# Altium schematic sheet oled.SchDoc
size A4
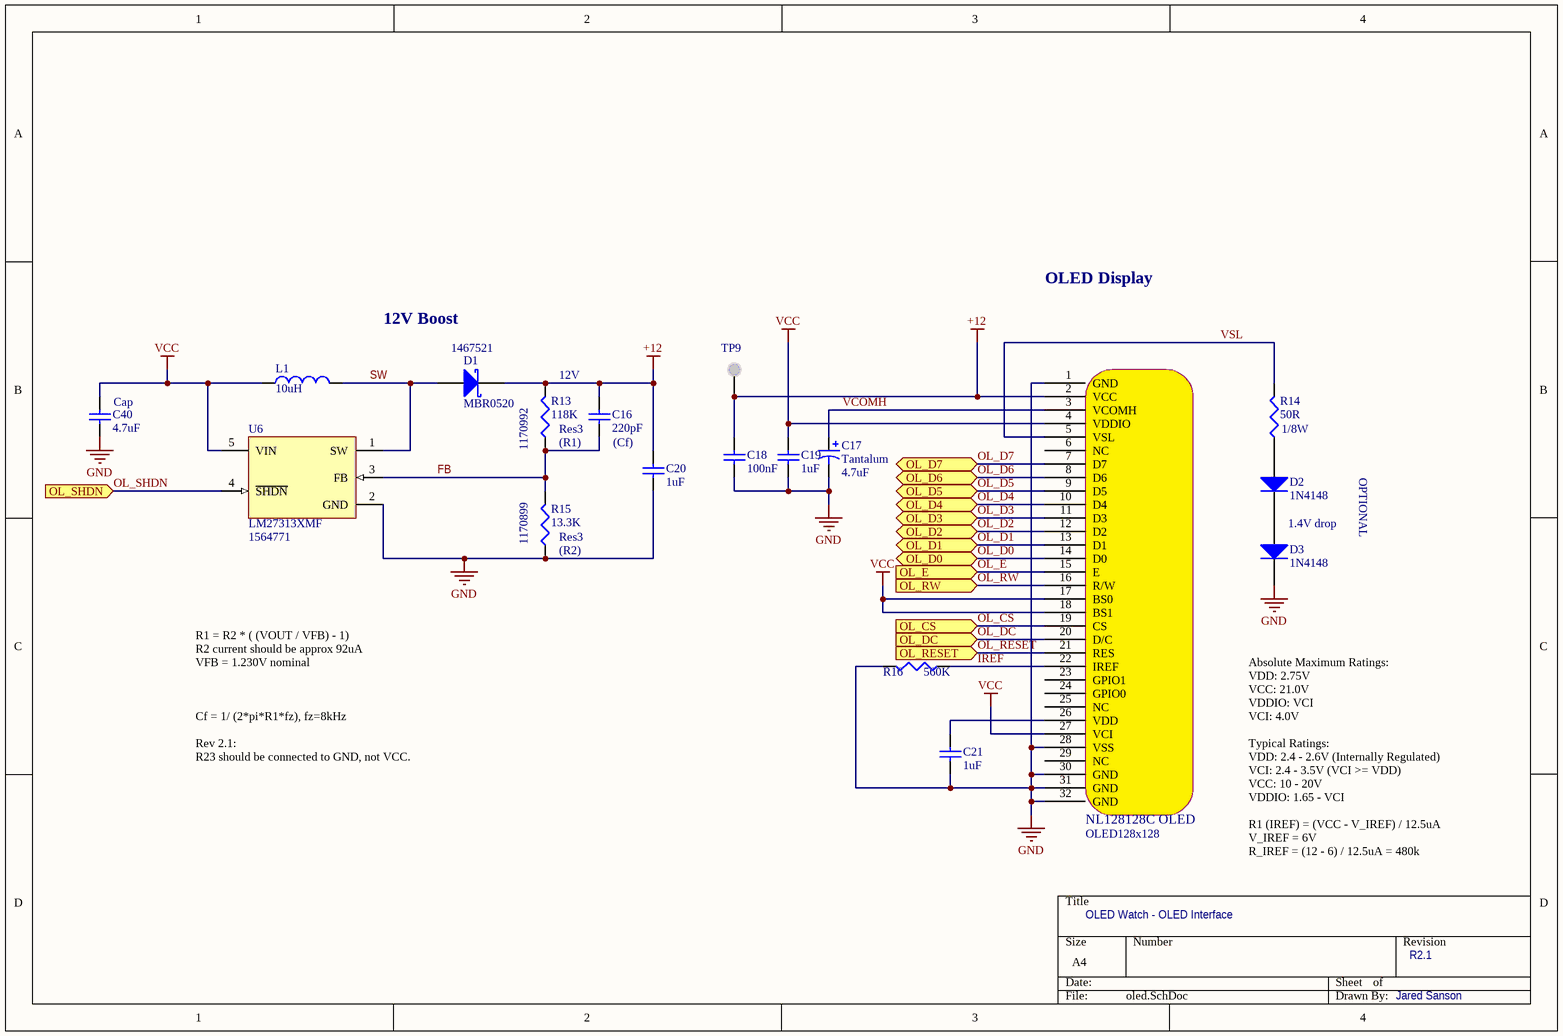
[diagram p0: oled.SchDoc]

## Parts
C16  value 220pF  Variable: (Cf)  [0603C]  (hidden comment: Cap)
C17  Tantalum  value 4.7uF  [0805C]
C18  value 100nF  [0603C]  (hidden comment: Cap)
C19  value 1uF  [0603C]  (hidden comment: Cap)
C20  value 1uF  [0805C]  (hidden comment: Cap)
C21  value 1uF  [0805C]  (hidden comment: Cap)
C40  Cap  value 4.7uF  [0805C]
D1  MBR0520  Supplier Part Number 1: 1467521  [0603D]
D2  1N4148  [0603D]
D3  1N4148  [0603D]
L1  value 10uH  [INDC3225N]  (hidden comment: Inductor)
OLED128x128  OLED128x128  [OLED128X128]  (value not drawn)
R13  Res3  value 118K  Variable: (R1)  Supplier Part Number 1: 1170992  [0603R]
R14  value 50R  [0603R]  (hidden comment: Res3)
R15  Res3  value 13.3K  Variable: (R2)  Supplier Part Number 1: 1170899  [0603R]
R16  value 560K  [0603R]  (hidden comment: Res3)
TP9  +12  [TESTPOINT_TOP]  (value not drawn)
U6  LM27313XMF  Supplier Part Number 1: 1564771  [MF05A_N]

## Ports
OL_CS (in), OL_D0 (bidir), OL_D1 (bidir), OL_D2 (bidir), OL_D3 (bidir), OL_D4 (bidir), OL_D5 (bidir), OL_D6 (bidir), OL_D7 (bidir), OL_DC (in), OL_E (in), OL_RESET (in), OL_RW (in), OL_SHDN (in)

## Nets
+12: C16.1 C18.1 C20.1 D1.2(K) OLED128x128.2(VCC) R13.2 TP9.1(TP)
GND: C17.2 C18.2 C19.2 C20.2 C21.2 C40.2 D3.2(K) OLED128x128.1(GND) OLED128x128.28(VSS) OLED128x128.30(GND) OLED128x128.31(GND) OLED128x128.32(GND) R15.1 R16.2 U6.2(GND)
VCC: C19.1 C40.1 L1.1 OLED128x128.4(VDDIO) OLED128x128.17(BS0) OLED128x128.18(BS1) OLED128x128.27(VCI) U6.5(VIN)
FB: C16.2 R13.1 R15.2 U6.3(FB)
IREF: OLED128x128.22(IREF) R16.1
OL_CS: OLED128x128.19(CS) ; port OL_CS
OL_D0: OLED128x128.14(D0) ; port OL_D0
OL_D1: OLED128x128.13(D1) ; port OL_D1
OL_D2: OLED128x128.12(D2) ; port OL_D2
OL_D3: OLED128x128.11(D3) ; port OL_D3
OL_D4: OLED128x128.10(D4) ; port OL_D4
OL_D5: OLED128x128.9(D5) ; port OL_D5
OL_D6: OLED128x128.8(D6) ; port OL_D6
OL_D7: OLED128x128.7(D7) ; port OL_D7
OL_DC: OLED128x128.20(D/C) ; port OL_DC
OL_E: OLED128x128.15(E) ; port OL_E
OL_RESET: OLED128x128.21(RES) ; port OL_RESET
OL_RW: OLED128x128.16(R/W) ; port OL_RW
OL_SHDN: U6.4(~{SHDN}) ; port OL_SHDN
SW: D1.1(A) L1.2 U6.1(SW)
VCOMH: C17.1 OLED128x128.3(VCOMH)
VSL: OLED128x128.5(VSL) R14.2
NetC21_1: C21.1 OLED128x128.26(VDD)
NetD2_1: D2.1(A) R14.1
NetD2_2: D2.2(K) D3.1(A)

Not connected (* = marked no-connect by the designer): OLED128x128 6(NC) 23(GPIO1) 24(GPIO0) 25(NC) 29(NC)

## Notes on the sheet
- OLED Display
- 12V Boost
- (near R13) 12V
- (near R14) 1/8W
- OPTIONAL
- 1.4V drop
- R1 = R2 * ( (VOUT / VFB) - 1)
  R2 current should be approx 92uA
  VFB = 1.230V nominal
  Cf = 1/ (2*pi*R1*fz), fz=8kHz
  Rev 2.1:
  R23 should be connected to GND, not VCC.
- OLED Watch - OLED Interface
- Absolute Maximum Ratings:
  VDD: 2.75V
  VCC: 21.0V
  VDDIO: VCI
  VCI: 4.0V
  Typical Ratings:
  VDD: 2.4 - 2.6V (Internally Regulated)
  VCI: 2.4 - 3.5V (VCI >= VDD)
  VCC: 10 - 20V
  VDDIO: 1.65 - VCI
  R1 (IREF) = (VCC - V_IREF) / 12.5uA
  V_IREF = 6V
  R_IREF = (12 - 6) / 12.5uA = 480k
- R2.1
- Jared Sanson
- (in symbol O) NL128128C OLED

## Library data of the parts
C16 C18-C21 C40 = Cap: Capacitor; Published: 8-Jun-2000; LatestRevisionDate: 17-Jul-2002; LatestRevisionNote: Re-released for DXP Platform.; PackageReference: RAD-0.3; Publisher: Altium Limited; PackageDescription: Radial Cap, Thru-Hole; 2 Leads; 0.3 in Pin Spacing
C17 = Cap Pol1: Polarized Capacitor (Radial); Published: 8-Jun-2000; LatestRevisionDate: 17-Jul-2002; LatestRevisionNote: Re-released for DXP Platform.; PackageReference: RB7.6-15; Publisher: Altium Limited; PackageDescription: Polarized Capacitor (Radial); 2 Leads
D1 = D Schottky: Schottky Diode; Published: 8-Jun-2000; LatestRevisionDate: 17-Jul-2002; LatestRevisionNote: Re-released for DXP Platform.; PackageReference: SMB; Publisher: Altium Limited; PackageDescription: DO-214-AA/SMB; 2 C-Bend Leads; Body 5.3 x 3.6 mm, inc. leads (LxW); Code_JEDEC: DO-214-AA; Supplier 1: Farnell
D2 D3 = Diode: Default Diode; Published: 8-Jun-2000; LatestRevisionDate: 17-Jul-2002; LatestRevisionNote: Re-released for DXP Platform.; PackageVersion: Sep-1996; PackageReference: SMC; Publisher: Altium Limited; PackageDescription: DO-214-AB/SMC; 2 C-Bend Leads; Body 7.9 x 5.9 mm, inc. leads (LxW); Code_JEDEC: DO-214-AB
L1 = Inductor: Code_IEC: 1005; Published: 8-Jun-2000; LatestRevisionDate: 29-May-2009; LatestRevisionNote: IPC-7351 Footprint Added.; PackageReference: 0402-A; Publisher: Altium Limited; PackageDescription: Chip Inductor; Code_JEITA: 0402
OLED128x128 = O: OLED
R13-R16 = Res3: Resistor; Published: 8-Jun-2000; LatestRevisionDate: 29-May-2009; LatestRevisionNote: IPC-7351 Footprint Added.; PackageReference: J1-0603; Publisher: Altium Limited; PackageDescription: Chip Resistor
  R13 R15: Supplier 1: Farnell
TP9 = TestPoint: Test Point; Comment_1: *
U6 = LM27313XMF: 1.6 MHz Boost Converter With 30V Internal FET Switch in SOT-23; Manufacturer: National Semiconductor; CompType: Switcher; PackageTopMarking: SRPB*XTT; PowerWise: N; FirstPublished: 4-Dec-2008; DatasheetVersion: Jul-2007; PackageVersion: revD, Aug-2008; PackageReference: MF05A; Publisher: Altium Limited; PackageDescription: Molded SOT-23, .115 x .063 x .040 in Body, 5 Lead, .0375 in Pitch; PartNumber: LM27313XMF; RoHS: O; PinCount: 5; DigiKeyPartNumber: LM27313XMFCT-ND; ComponentLink1Description: LM27313 Datasheet; ComponentLink1URL: http://www.national.com/ds/LM/LM27313.pdf; ComponentLink2Description: LM27313 Web Page; ComponentLink2URL: http://www.national.com/pf/LM/LM27313.html; ComponentLink3Description: MF05A Package Page; ComponentLink3URL: http://www.national.com/packaging/folders/mf05a.html; Supplier 1: Farnell